# Altium schematic sheet [4] Temperature_readings.SchDoc
size A4; DocumentNumber: 5; SheetNumber: 5; SheetTotal: 6
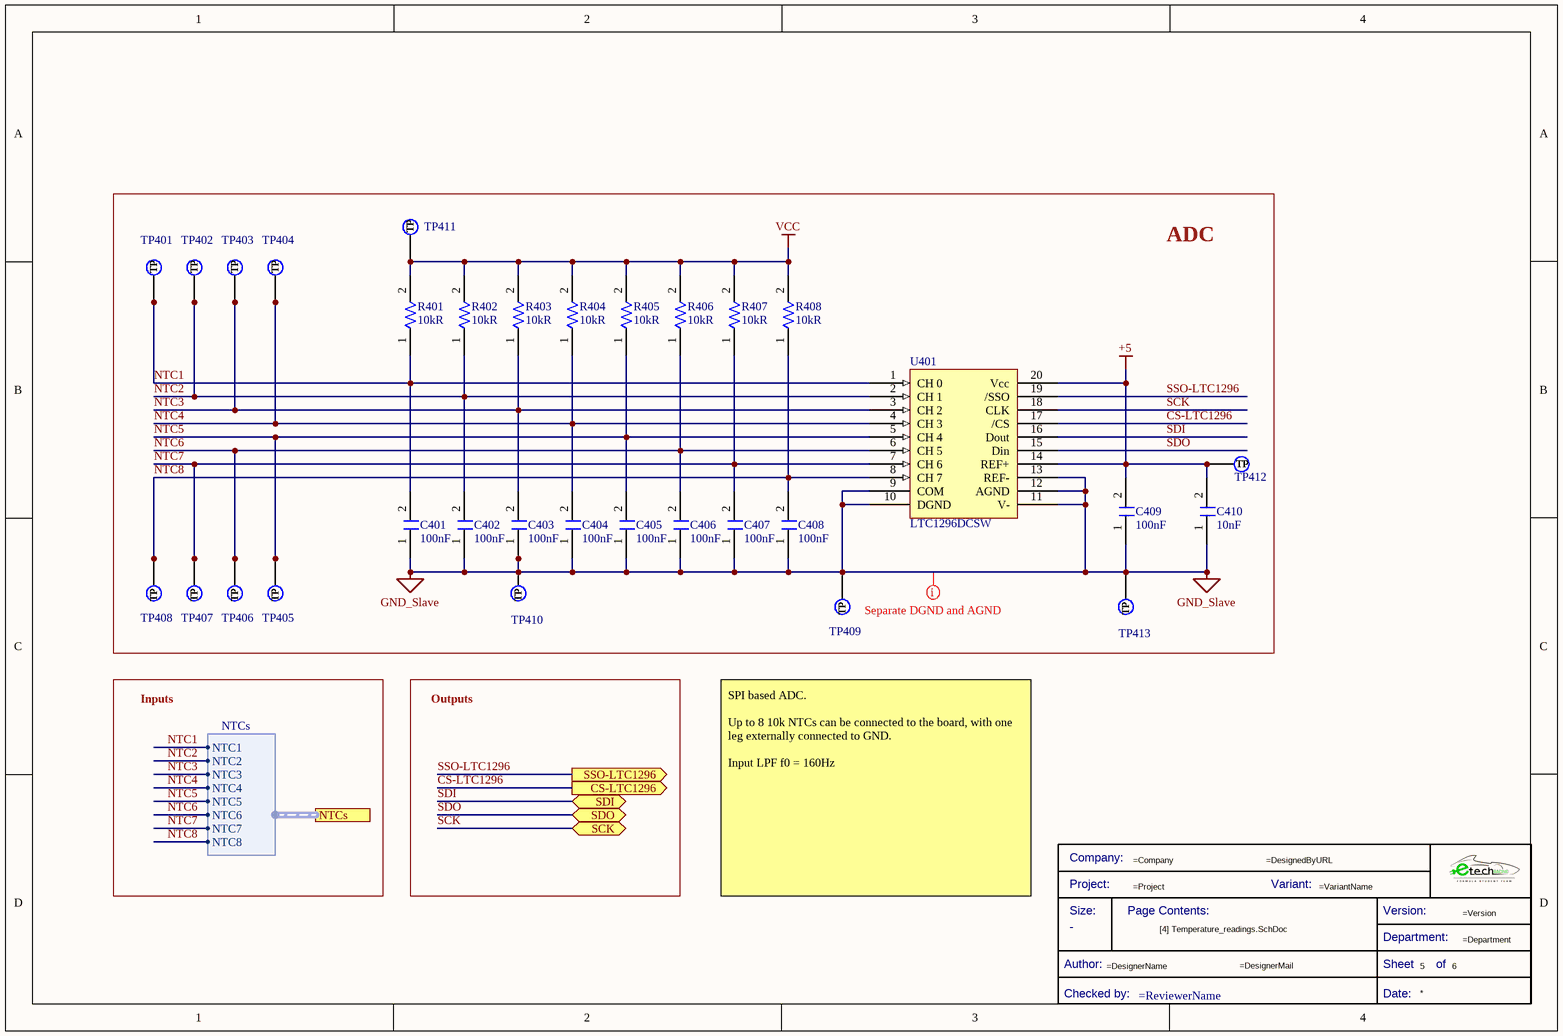
[diagram p0: [4] Temperature_readings.SchDoc]

## Parts
*  Title Block_template  (value not drawn)  (graphical)
C401  Capacitance: 100nF  [C0805FNPC-R]  (hidden comment: 885012207098)
C402  Capacitance: 100nF  [C0805FNPC-R]  (hidden comment: 885012207098)
C403  Capacitance: 100nF  [C0805FNPC-R]  (hidden comment: 885012207098)
C404  Capacitance: 100nF  [C0805FNPC-R]  (hidden comment: 885012207098)
C405  Capacitance: 100nF  [C0805FNPC-R]  (hidden comment: 885012207098)
C406  Capacitance: 100nF  [C0805FNPC-R]  (hidden comment: 885012207098)
C407  Capacitance: 100nF  [C0805FNPC-R]  (hidden comment: 885012207098)
C408  Capacitance: 100nF  [C0805FNPC-R]  (hidden comment: 885012207098)
C409  Capacitance: 100nF  [C0805FNPC-R]  (hidden comment: 885012207098)
C410  Capacitance: 10nF  [C0805FNPC-R]  (hidden comment: 885012207092)
R401  Resistance: 10kR  [R0805FTK]  (hidden comment: CR0805-JW-103ELF)
R402  Resistance: 10kR  [R0805FTK]  (hidden comment: CR0805-JW-103ELF)
R403  Resistance: 10kR  [R0805FTK]  (hidden comment: CR0805-JW-103ELF)
R404  Resistance: 10kR  [R0805FTK]  (hidden comment: CR0805-JW-103ELF)
R405  Resistance: 10kR  [R0805FTK]  (hidden comment: CR0805-JW-103ELF)
R406  Resistance: 10kR  [R0805FTK]  (hidden comment: CR0805-JW-103ELF)
R407  Resistance: 10kR  [R0805FTK]  (hidden comment: CR0805-JW-103ELF)
R408  Resistance: 10kR  [R0805FTK]  (hidden comment: CR0805-JW-103ELF)
TP401  TestPoint  [TestPoint]  (value not drawn)  (no BOM)
TP402  TestPoint  [TestPoint]  (value not drawn)  (no BOM)
TP403  TestPoint  [TestPoint]  (value not drawn)  (no BOM)
TP404  TestPoint  [TestPoint]  (value not drawn)  (no BOM)
TP405  TestPoint  [TestPoint]  (value not drawn)  (no BOM)
TP406  TestPoint  [TestPoint]  (value not drawn)  (no BOM)
TP407  TestPoint  [TestPoint]  (value not drawn)  (no BOM)
TP408  TestPoint  [TestPoint]  (value not drawn)  (no BOM)
TP409  TestPoint  [TestPoint]  (value not drawn)  (no BOM)
TP410  TestPoint  [TestPoint]  (value not drawn)  (no BOM)
TP411  TestPoint  [TestPoint]  (value not drawn)  (no BOM)
TP412  TestPoint  [TestPoint]  (value not drawn)  (no BOM)
TP413  TestPoint  [TestPoint]  (value not drawn)  (no BOM)
U401  Manufacturer Part Number 1: LTC1296DCSW  [ADC_LTC1296]  (hidden comment: LTC1296)

## Blocks framed on the sheet
ADC: C401-C410 R401-R408 TP401-TP413 U401

## Ports
CS-LTC1296 (out), NTCs (harness NTCs), SCK (bidir), SDI (bidir), SDO (bidir), SSO-LTC1296 (out)

## Harnesses
NTCs: NTC2, NTC3, NTC4, NTC5, NTC6, NTC7, NTC8, NTC1

## Nets
+5: C409.2 C410.2 TP412.1(TP) U401.14(REF+) U401.20(Vcc)
GND_Slave: C401.1 C402.1 C403.1 C404.1 C405.1 C406.1 C407.1 C408.1 C409.1 C410.1 TP409.1(TP) TP410.1(TP) TP413.1(TP) U401.9(COM) U401.10(DGND) U401.11(V-) U401.12(AGND) U401.13(REF-)
VCC: R401.2 R402.2 R403.2 R404.2 R405.2 R406.2 R407.2 R408.2 TP411.1(TP)
CS-LTC1296: U401.17(/CS) ; port CS-LTC1296
NTC1: C401.2 R401.1 TP401.1(TP) U401.1(CH_0) ; port NTCs.NTC1
NTC2: C402.2 R402.1 TP402.1(TP) U401.2(CH_1) ; port NTCs.NTC2
NTC3: C403.2 R403.1 TP403.1(TP) U401.3(CH_2) ; port NTCs.NTC3
NTC4: C404.2 R404.1 TP404.1(TP) U401.4(CH_3) ; port NTCs.NTC4
NTC5: C405.2 R405.1 TP405.1(TP) U401.5(CH_4) ; port NTCs.NTC5
NTC6: C406.2 R406.1 TP406.1(TP) U401.6(CH_5) ; port NTCs.NTC6
NTC7: C407.2 R407.1 TP407.1(TP) U401.7(CH_6) ; port NTCs.NTC7
NTC8: C408.2 R408.1 TP408.1(TP) U401.8(CH_7) ; port NTCs.NTC8
SCK: U401.18(CLK) ; port SCK
SDI: U401.16(Dout) ; port SDI
SDO: U401.15(Din) ; port SDO
SSO-LTC1296: U401.19(/SSO) ; port SSO-LTC1296

## Layout directives
mark named Separate DGND and AGND: GND_Slave

## Notes on the sheet
- Inputs
- Outputs
- SPI based ADC.
  Up to 8 10k NTCs can be connected to the board, with one leg externally connected to GND.
  Input LPF f0 = 160Hz
- Title
- Size:
- Date:
- A4
- Number:
- Time:
- Revision:
- Sheet
- of
- File:
- (in symbol Title Block_template) Company:; Project:; Variant:; Size:; Page Contents:; Version:; Department:; Author:; Sheet; of; Checked by:; Date:

## Library data of the parts
* = Title Block_template: Standard Title Block; Category: Title Block; Checked by:: =ReviewerName; Size: -
C401-C409 = C100n-50V-0805FNPC-X7R: Cap, 0.1ΜF, 50V, 10%, X7R, 0805; Manufacturer 1: Wurth Electronics; .Creator: DR; Supplier 1: RSComponents; Manufacturer Part Number 1: 885012207098; RoHS: Yes; Category: Ceramic Capacitors; Stock 1: 8000; Pricing 1: 100=0,10200, 500=0,07100, 2000=0,06100 (GBP); Mount: Surface Mount; Case/Package: 0805; Case Code (Metric): 2012; Case Code (Imperial): 0805; Min Operating Temperature: -55°C; Max Operating Temperature: 125°C; Packaging: Cut Tape; Voltage Rating: 50V; Dielectric: X7R; Tolerance: 10%; Voltage Rating (DC): 50V; Length: 0.079inch; Width: 0.049inch; Thickness: 0.035inch; REACH SVHC: Unknown; RoHS Compliant: Yes; ComponentLink1URL: http://www.farnell.com/datasheets/1958498.pdf?src-supplier=Farnell; ComponentLink1Description: http://www.farnell.com/datasheets/1958498.pdf?src-supplier=Farnell; ComponentLink2URL: http://www.farnell.com/datasheets/1958498.pdf?src-supplier=Element14; ComponentLink2Description: http://www.farnell.com/datasheets/1958498.pdf?src-supplier=Element14; ComponentLink3URL: https://katalog.we-online.de/pbs/datasheet/885012207098.pdf?src-supplier=Digi-Key; ComponentLink3Description: https://katalog.we-online.de/pbs/datasheet/885012207098.pdf?src-supplier=Digi-Key; ComponentLink4URL: http://www.farnell.com/datasheets/1958498.pdf?src-supplier=Newark; ComponentLink4Description: http://www.farnell.com/datasheets/1958498.pdf?src-supplier=Newark; Supplier Part Number 1: 1813493
C410 = C10n-50V-0805FNPC-X7R: Cap, 0.01ΜF, 50V, 10%, X7R, 0805; Manufacturer 1: Wurth Electronics; .Creator: DR; Supplier 1: RSComponents; Manufacturer Part Number 1: 885012207092; RoHS: Yes; Category: Ceramic Capacitors; Stock 1: 1; Pricing 1: 4000=0,03200, 12000=0,03100 (USD); Mount: Surface Mount; Case/Package: 0805; Case Code (Metric): 2012; Case Code (Imperial): 0805; Min Operating Temperature: -55°C; Max Operating Temperature: 125°C; Packaging: Cut Tape; Voltage Rating: 50V; Dielectric: X7R; Tolerance: 10%; Voltage Rating (DC): 50V; Length: 0.079inch; Width: 0.049inch; Thickness: 0.035inch; REACH SVHC: Unknown; RoHS Compliant: Yes; ComponentLink1URL: http://www.farnell.com/datasheets/1958497.pdf?src-supplier=Farnell; ComponentLink1Description: http://www.farnell.com/datasheets/1958497.pdf?src-supplier=Farnell; ComponentLink2URL: http://www.farnell.com/datasheets/1958497.pdf?src-supplier=Element14; ComponentLink2Description: http://www.farnell.com/datasheets/1958497.pdf?src-supplier=Element14; ComponentLink3URL: http://www.farnell.com/datasheets/1958497.pdf?src-supplier=Newark; ComponentLink3Description: http://www.farnell.com/datasheets/1958497.pdf?src-supplier=Newark; ComponentLink4URL: https://katalog.we-online.de/pbs/datasheet/885012207092.pdf?src-supplier=Digi-Key; ComponentLink4Description: https://katalog.we-online.de/pbs/datasheet/885012207092.pdf?src-supplier=Digi-Key; Supplier Part Number 1: 1813941
R401-R408 = R10k-0805FTK: BOURNS         CR0805-JW-103ELF            Surface Mount Chip Resistor, Thick Film, CR Series, 10 kohm, 125 mW,  5%, 150 V; Temperature Coefficient: 200ppm/°C; Power Rating: 125mW; Voltage Rating: 150V; Voltage Rating (DC): 100V; .Creator: DR; Supplier 1: Arrow Electronics; Manufacturer 1: Bourns; Manufacturer Part Number 1: CR0805-JW-103ELF; RoHS: Yes; Category: Chip SMD Resistors; Stock 1: 57566; Pricing 1: 1=0,05790, 10=0,01540, 25=0,01340, 100=0,00340 (USD); Mount: Surface Mount; Case/Package: 0805; Number of Pins: 2; Contact Plating: Tin; Case Code (Metric): 2012; Case Code (Imperial): 0805; Min Operating Temperature: -55°C; Max Operating Temperature: 155°C; Tolerance: 5%; Resistor Type: Thick Film; Package Quantity: 1; Packaging: Tape and Reel; Number of Terminations: 2; Termination: SMD/SMT; Max Power Dissipation: 125mW; Features: Moisture Resistant; Series: CR0805; Construction: Rectangular; Resistance Tolerance: 5%; Technology: THICK FILM; Length: 2mm; Width: 1.25mm; Height: 0.5mm; Depth: 1.25mm; Thickness: 508um; Radiation Hardening: No; REACH SVHC: No SVHC; Military Standard: Not; RoHS Compliant: Yes; ComponentLink1URL: https://datasheet.ciiva.com/11821/0900766b80fcdb72-11821135.pdf?src-supplier=RSComponents; ComponentLink1Description: https://datasheet.ciiva.com/11821/0900766b80fcdb72-11821135.pdf?src-supplier=RSComponents; ComponentLink2URL: https://datasheet.ciiva.com/9122/chpreztr-9122374.pdf?src-supplier=Avnet; ComponentLink2Description: https://datasheet.ciiva.com/9122/chpreztr-9122374.pdf?src-supplier=Avnet; ComponentLink3URL: https://datasheet.ciiva.com/22693/1902866-22693254.pdf?src-supplier=Element14; ComponentLink3Description: https://datasheet.ciiva.com/22693/1902866-22693254.pdf?src-supplier=Element14; ComponentLink4URL: https://datasheet.ciiva.com/7986/691949-7986187.pdf?src-supplier=Element14; ComponentLink4Description: https://datasheet.ciiva.com/7986/691949-7986187.pdf?src-supplier=Element14; ComponentLink5URL: https://datasheet.ciiva.com/30065/159chpreztr-30065976.pdf?src-supplier=Onlinecomponents.com; ComponentLink5Description: https://datasheet.ciiva.com/30065/159chpreztr-30065976.pdf?src-supplier=Onlinecomponents.com; ComponentLink6URL: https://datasheet.ciiva.com/16783/70154685-16783482.pdf?src-supplier=Allied+Electronics; ComponentLink6Description: https://datasheet.ciiva.com/16783/70154685-16783482.pdf?src-supplier=Allied+Electronics; ComponentLink7URL: https://datasheet.ciiva.com/5548/chpreztr-5548491.pdf?src-supplier=Mouser; ComponentLink7Description: https://datasheet.ciiva.com/5548/chpreztr-5548491.pdf?src-supplier=Mouser; ComponentLink8URL: https://datasheet.ciiva.com/6559/chpreztr-6559900.pdf?src-supplier=Digi-Key; ComponentLink8Description: https://datasheet.ciiva.com/6559/chpreztr-6559900.pdf?src-supplier=Digi-Key; ComponentLink9URL: https://datasheet.ciiva.com/6559/chpreztr-6559901.pdf?src-supplier=Digi-Key; ComponentLink9Description: https://datasheet.ciiva.com/6559/chpreztr-6559901.pdf?src-supplier=Digi-Key; ComponentLink10URL: https://datasheet.ciiva.com/7985/1856384-7985869.pdf?src-supplier=Element14; ComponentLink10Description: https://datasheet.ciiva.com/7985/1856384-7985869.pdf?src-supplier=Element14; ComponentLink11URL: https://datasheet.ciiva.com/48692/001055517-da-01-en-smd-wid-cr0805-jw-103elf-10k-ohm-1-8w-48692118.pdf?src-supplier=Conrad; ComponentLink11Description: https://datasheet.ciiva.com/48692/001055517-da-01-en-smd-wid-cr0805-jw-103elf-10k-ohm-1-8w-48692118.pdf?src-supplier=Conrad; Supplier Part Number 1: CR0805-JW-103ELF
TP401-TP413 = TestPoint: Test Point 1x1 mm; .Creator: GP; Category: TestPoint; .PCBcheck: GP; .SCHcheck: GP
U401 = ADC-LTC1296: 8-Channel Single ADC SAR 46.5ksps 12-bit Serial 20-Pin SOIC W; Manufacturer 1: Analog Devices / Linear Technology; Interface: Serial,Parallel; Sampling Rate: 46500S/s; Resolution: 12b; Supply Type: Dual; Number of Bits: 12; Max Supply Voltage: 12V; Dual Supply Voltage: 5V; Number of Elements: 1; Polarity: Bipolar,Unipolar; Power Dissipation: 500mW; Integral Nonlinearity (INL): 0.75LSB; .Creator: DR; ComponentLink1Description: Datasheet; ComponentLink2Description: Where buy it; Supplier 1: Newark; RoHS: No; Category: Analog to Digital Converters (ADCs); Mount: Surface Mount; Case/Package: SOIC; Number of Pins: 20; Min Operating Temperature: 0°C; Max Operating Temperature: 70°C; Package Quantity: 38; Packaging: Rail/Tube; Operating Supply Voltage: 5V; Lead Free: Contains Lead; RoHS Compliant: No; ComponentLink3URL: https://datasheet.ciiva.com/1250/3526-1250235.pdf?src-supplier=Digi-Key; ComponentLink3Description: https://datasheet.ciiva.com/1250/3526-1250235.pdf?src-supplier=Digi-Key; Supplier Part Number 1: 56M0212